# Altium schematic sheet Sheet5.SchDoc
size A4
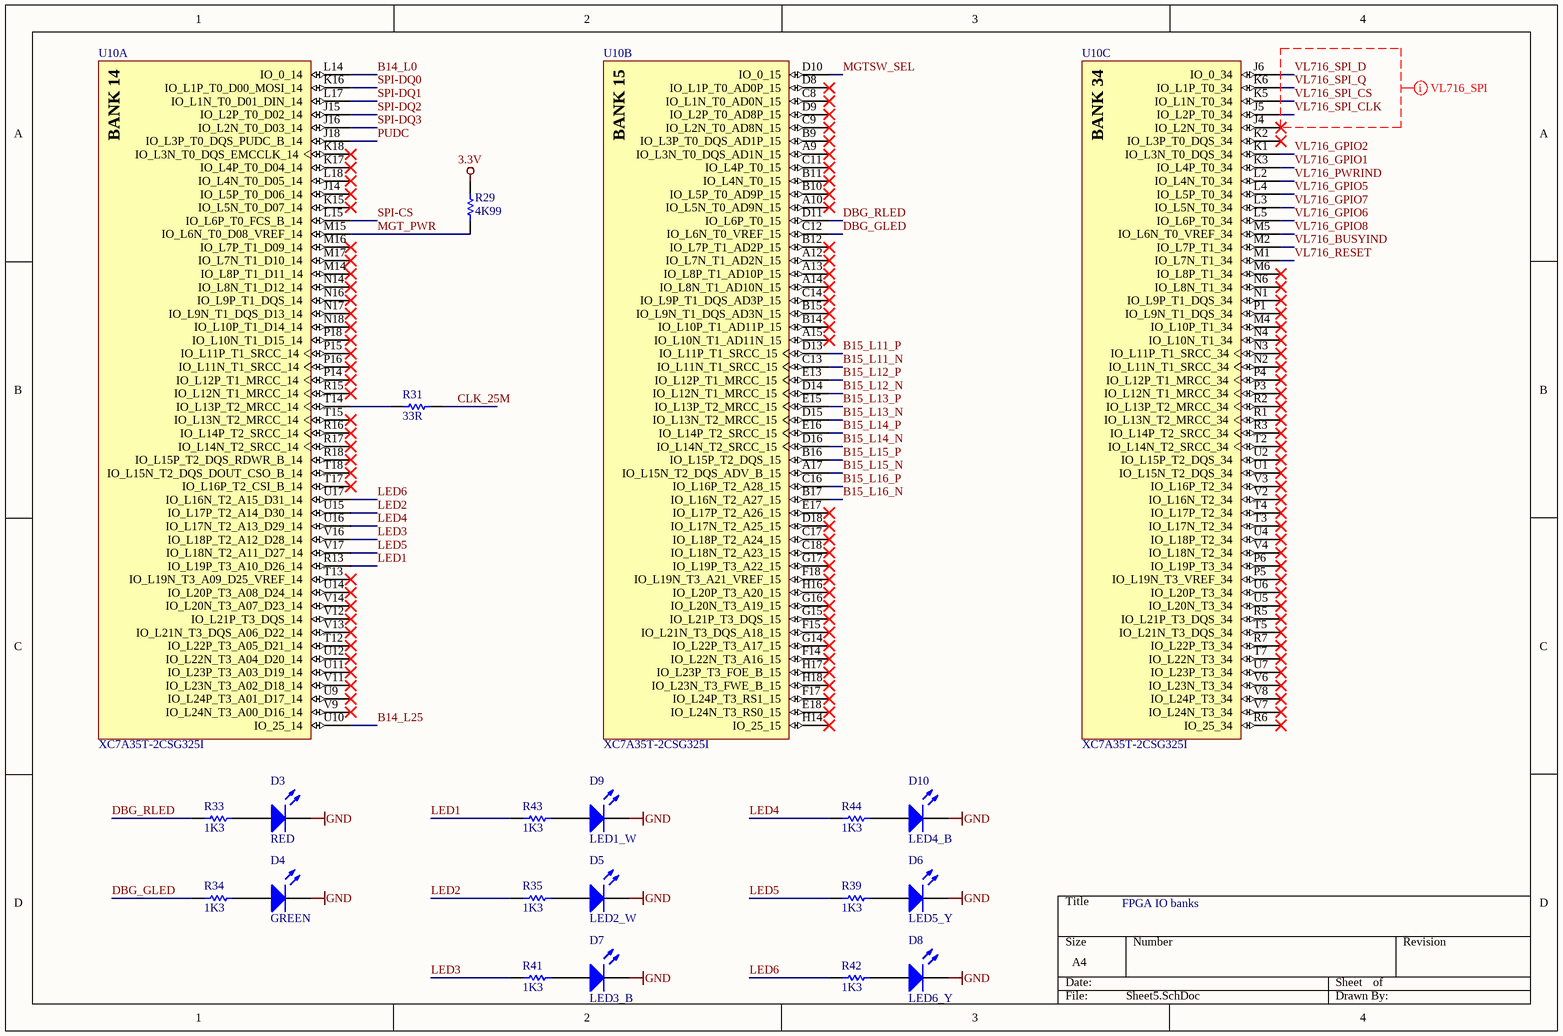
[diagram p0: Sheet5.SchDoc]

## Parts
D3  RED  [LEDC2012X10N]
D4  GREEN  [LEDC2012X10N]
D5  LED2_W  [LEDC2012X10N]
D6  LED5_Y  [LEDC2012X10N]
D7  LED3_B  [LEDC2012X10N]
D8  LED6_Y  [LEDC2012X10N]
D9  LED1_W  [LEDC2012X10N]
D10  LED4_B  [LEDC2012X10N]
R29  4K99  [RESC1005X05N]
R31  33R  [RESC1005X05N]
R33  1K3  [RESC1005X05N]
R34  1K3  [RESC1005X05N]
R35  1K3  [RESC1005X05N]
R39  1K3  [RESC1005X05N]
R41  1K3  [RESC1005X05N]
R42  1K3  [RESC1005X05N]
R43  1K3  [RESC1005X05N]
R44  1K3  [RESC1005X05N]
U10  XC7A35T-2CSG325I  [XC7A35T-2CSG325I]  (parts A,B,C of 9)

## Nets
3.3V: R29.1
GND: D3.1(K) D4.1(K) D5.1(K) D6.1(K) D7.1(K) D8.1(K) D9.1(K) D10.1(K)
B14_L0: U10.L14(IO_0_14)
B14_L25: U10.U10(IO_25_14)
B15_L11_N: U10.C13(IO_L11N_T1_SRCC_15)
B15_L11_P: U10.D13(IO_L11P_T1_SRCC_15)
B15_L12_N: U10.D14(IO_L12N_T1_MRCC_15)
B15_L12_P: U10.E13(IO_L12P_T1_MRCC_15)
B15_L13_N: U10.D15(IO_L13N_T2_MRCC_15)
B15_L13_P: U10.E15(IO_L13P_T2_MRCC_15)
B15_L14_N: U10.D16(IO_L14N_T2_SRCC_15)
B15_L14_P: U10.E16(IO_L14P_T2_SRCC_15)
B15_L15_N: U10.A17(IO_L15N_T2_DQS_ADV_B_15)
B15_L15_P: U10.B16(IO_L15P_T2_DQS_15)
B15_L16_N: U10.B17(IO_L16N_T2_A27_15)
B15_L16_P: U10.C16(IO_L16P_T2_A28_15)
CLK_25M: R31.2
DBG_GLED: R34.2 U10.C12(IO_L6N_T0_VREF_15)
DBG_RLED: R33.2 U10.D11(IO_L6P_T0_15)
LED1: R43.2 U10.R13(IO_L19P_T3_A10_D26_14)
LED2: R35.2 U10.U15(IO_L17P_T2_A14_D30_14)
LED3: R41.2 U10.V16(IO_L18P_T2_A12_D28_14)
LED4: R44.2 U10.U16(IO_L17N_T2_A13_D29_14)
LED5: R39.2 U10.V17(IO_L18N_T2_A11_D27_14)
LED6: R42.2 U10.U17(IO_L16N_T2_A15_D31_14)
MGT_PWR: R29.2 U10.M15(IO_L6N_T0_D08_VREF_14)
MGTSW_SEL: U10.D10(IO_0_15)
PUDC: U10.J18(IO_L3P_T0_DQS_PUDC_B_14)
SPI-CS: U10.L15(IO_L6P_T0_FCS_B_14)
SPI-DQ0: U10.K16(IO_L1P_T0_D00_MOSI_14)
SPI-DQ1: U10.L17(IO_L1N_T0_D01_DIN_14)
SPI-DQ2: U10.J15(IO_L2P_T0_D02_14)
SPI-DQ3: U10.J16(IO_L2N_T0_D03_14)
VL716_BUSYIND: U10.M2(IO_L7P_T1_34)
VL716_GPIO1: U10.K3(IO_L4P_T0_34)
VL716_GPIO2: U10.K1(IO_L3N_T0_DQS_34)
VL716_GPIO5: U10.L4(IO_L5P_T0_34)
VL716_GPIO6: U10.L5(IO_L6P_T0_34)
VL716_GPIO7: U10.L3(IO_L5N_T0_34)
VL716_GPIO8: U10.M5(IO_L6N_T0_VREF_34)
VL716_PWRIND: U10.L2(IO_L4N_T0_34)
VL716_RESET: U10.M1(IO_L7N_T1_34)
VL716_SPI_CLK: U10.J5(IO_L2P_T0_34)
VL716_SPI_CS: U10.K5(IO_L1N_T0_34)
VL716_SPI_D: U10.J6(IO_0_34)
VL716_SPI_Q: U10.K6(IO_L1P_T0_34)
NetD3_2: D3.2(A) R33.1
NetD4_2: D4.2(A) R34.1
NetD5_2: D5.2(A) R35.1
NetD6_2: D6.2(A) R39.1
NetD7_2: D7.2(A) R41.1
NetD8_2: D8.2(A) R42.1
NetD9_2: D9.2(A) R43.1
NetD10_2: D10.2(A) R44.1
NetR31_1: R31.1 U10.T14(IO_L13P_T2_MRCC_14)

Not connected (* = marked no-connect by the designer): U10 A9(IO_L3N_T0_DQS_AD1N_15)* A10(IO_L5N_T0_AD9N_15)* A12(IO_L7N_T1_AD2N_15)* A13(IO_L8P_T1_AD10P_15)* A14(IO_L8N_T1_AD10N_15)* A15(IO_L10N_T1_AD11N_15)* B9(IO_L3P_T0_DQS_AD1P_15)* B10(IO_L5P_T0_AD9P_15)* B11(IO_L4N_T0_15)* B12(IO_L7P_T1_AD2P_15)* B14(IO_L10P_T1_AD11P_15)* B15(IO_L9N_T1_DQS_AD3N_15)* C8(IO_L1N_T0_AD0N_15)* C9(IO_L2N_T0_AD8N_15)* C11(IO_L4P_T0_15)* C14(IO_L9P_T1_DQS_AD3P_15)* C17(IO_L18P_T2_A24_15)* C18(IO_L18N_T2_A23_15)* D8(IO_L1P_T0_AD0P_15)* D9(IO_L2P_T0_AD8P_15)* D18(IO_L17N_T2_A25_15)* E17(IO_L17P_T2_A26_15)* E18(IO_L24N_T3_RS0_15)* F14(IO_L22N_T3_A16_15)* F15(IO_L21N_T3_DQS_A18_15)* F17(IO_L24P_T3_RS1_15)* F18(IO_L19N_T3_A21_VREF_15)* G14(IO_L22P_T3_A17_15)* G15(IO_L21P_T3_DQS_15)* G16(IO_L20N_T3_A19_15)* G17(IO_L19P_T3_A22_15)* H14(IO_25_15)* H16(IO_L20P_T3_A20_15)* H17(IO_L23P_T3_FOE_B_15)* H18(IO_L23N_T3_FWE_B_15)* J4(IO_L2N_T0_34)* J14(IO_L5P_T0_D06_14)* K2(IO_L3P_T0_DQS_34)* K15(IO_L5N_T0_D07_14)* K17(IO_L4P_T0_D04_14)* K18(IO_L3N_T0_DQS_EMCCLK_14)* L18(IO_L4N_T0_D05_14)* M4(IO_L10P_T1_34)* M6(IO_L8P_T1_34)* M14(IO_L8P_T1_D11_14)* M16(IO_L7P_T1_D09_14)* M17(IO_L7N_T1_D10_14)* N1(IO_L9P_T1_DQS_34)* N2(IO_L11N_T1_SRCC_34)* N3(IO_L11P_T1_SRCC_34)* N4(IO_L10N_T1_34)* N6(IO_L8N_T1_34)* N14(IO_L8N_T1_D12_14)* N16(IO_L9P_T1_DQS_14)* N17(IO_L9N_T1_DQS_D13_14)* N18(IO_L10P_T1_D14_14)* P1(IO_L9N_T1_DQS_34)* P3(IO_L12N_T1_MRCC_34)* P4(IO_L12P_T1_MRCC_34)* P5(IO_L19N_T3_VREF_34)* P6(IO_L19P_T3_34)* P14(IO_L12P_T1_MRCC_14)* P15(IO_L11P_T1_SRCC_14)* P16(IO_L11N_T1_SRCC_14)* P18(IO_L10N_T1_D15_14)* R1(IO_L13N_T2_MRCC_34)* R2(IO_L13P_T2_MRCC_34)* R3(IO_L14P_T2_SRCC_34)* R5(IO_L21P_T3_DQS_34)* R6(IO_25_34)* R7(IO_L22P_T3_34)* R15(IO_L12N_T1_MRCC_14)* R16(IO_L14P_T2_SRCC_14)* R17(IO_L14N_T2_SRCC_14)* R18(IO_L15P_T2_DQS_RDWR_B_14)* T2(IO_L14N_T2_SRCC_34)* T3(IO_L17N_T2_34)* T4(IO_L17P_T2_34)* T5(IO_L21N_T3_DQS_34)* T7(IO_L22N_T3_34)* T12(IO_L22P_T3_A05_D21_14)* T13(IO_L19N_T3_A09_D25_VREF_14)* T15(IO_L13N_T2_MRCC_14)* T17(IO_L16P_T2_CSI_B_14)* T18(IO_L15N_T2_DQS_DOUT_CSO_B_14)* U1(IO_L15N_T2_DQS_34)* U2(IO_L15P_T2_DQS_34)* U4(IO_L18P_T2_34)* U5(IO_L20N_T3_34)* U6(IO_L20P_T3_34)* U7(IO_L23P_T3_34)* U9(IO_L24P_T3_A01_D17_14)* U11(IO_L23P_T3_A03_D19_14)* U12(IO_L22N_T3_A04_D20_14)* U14(IO_L20P_T3_A08_D24_14)* V2(IO_L16N_T2_34)* V3(IO_L16P_T2_34)* V4(IO_L18N_T2_34)* V6(IO_L23N_T3_34)* V7(IO_L24N_T3_34)* V8(IO_L24P_T3_34)* V9(IO_L24N_T3_A00_D16_14)* V11(IO_L23N_T3_A02_D18_14)* V12(IO_L21P_T3_DQS_14)* V13(IO_L21N_T3_DQS_A06_D22_14)* V14(IO_L20N_T3_A07_D23_14)*

## Layout directives
net class VL716_SPI: VL716_SPI_CLK, VL716_SPI_CS, VL716_SPI_D, VL716_SPI_Q

## Notes on the sheet
- FPGA IO banks
- (in symbol XC7A35T-2CSG325I, part A) BANK 14
- (in symbol XC7A35T-2CSG325I, part B) BANK 15
- (in symbol XC7A35T-2CSG325I, part C) BANK 34

## Library data of the parts
D3 D5-D10 = LED0805: SMD chip LED
  D3: Text: RED
  D5: Text: LED2_W
  D6: Text: LED5_Y
  D7: Text: LED3_B
  D8: Text: LED6_Y
  D9: Text: LED1_W
  D10: Text: LED4_B
D4 = LED0805: SMD chip LED; Text: DONE
R29 R31 R33-R35 R39 R41-R44 = R0402: Ceramic Chip Resistor
  R29: Value: 4K99
  R31: Value: 33R
  R33-R35 R39 R41-R44: Value: 1K3
U10 = XC7A35T-2CSG325I: Artix-7 FPGA, 150 User I/Os, 4 GTP, 324-Ball BGA, Speed Grade 2, Industrial Grade, Pb-Free; Manufacturer: Xilinx; Total Block RAM: 1800 Kb; GTP: 4; Clock Mgmt Tiles (CMTs): 5; Logic Cells: 33280; Available User I/O: 150; Speed Grades: 2; DatasheetVersion: v1.15; PackageVersion: Rev. 1.11; PackageReference: CSG-325; PackageDescription: 324-Ball Wire-Bond Chip-Scale BGA, Body 15 x 15 mm, Pitch 0.8 mm; Maximum Distributed RAM: 400 Kb; Operating Temperature Range: Industrial; NexusDeviceID: XC7A35T-2CSG325I; Mounting Technology: Surface Mount; PartNumber: XC7A35T-2CSG325I; ComponentLink1Description: Manufacturer URL; ComponentLink1URL: http://www.xilinx.com/; ComponentLink2Description: Datasheet; ComponentLink2URL: http://www.xilinx.com/support/documentation/data_sheets/ds180_7Series_Overview.pdf; ComponentLink3Description: Package Specification; ComponentLink3URL: http://www.xilinx.com/support/documentation/user_guides/ug475_7Series_Pkg_Pinout.pdf; ComponentLink4Description: DC and Switching Characteristics; ComponentLink4URL: http://www.xilinx.com/support/documentation/data_sheets/ds181_Artix_7_Data_Sheet.pdf; ComponentLink5Description: Package File; ComponentLink5URL: http://www.xilinx.com/support/packagefiles/a7packages/xc7a200tsbg484pkg.txt; ComponentLink6Description: Packaging and Pinout; ComponentLink6URL: http://www.xilinx.com/support/documentation/user_guides/ug475_7Series_Pkg_Pinout.pdf